# EAGLE schematic Ex EEPROM (EAGLE 9.6.2)
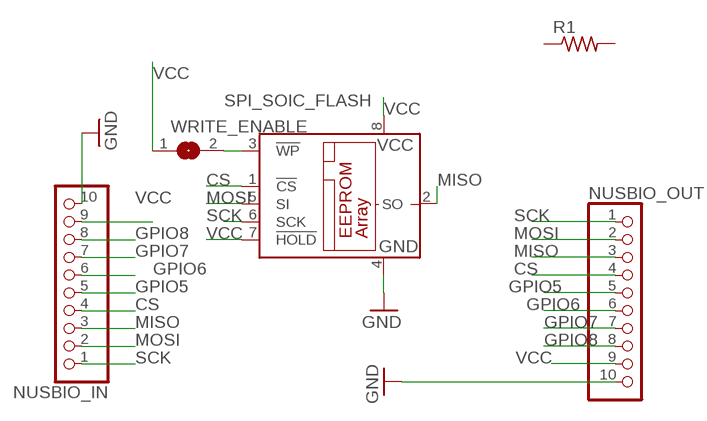
[diagram p0: schematic, sheet 1]

## Parts
NUSBIO_IN  PINHD-1X10  [1X10-BIG]
NUSBIO_OUT  PINHD-1X10  [1X10-BIG]
R1  R-US_R1206  [R1206]
SPI_SOIC_FLASH  25AA080SN  [SO-08]
WRITE_ENABLE  SOLDERJUMPERREFLOW  [SOLDERJUMPER_REFLOW]

## Nets
CS: NUSBIO_IN.4 NUSBIO_OUT.4 SPI_SOIC_FLASH.1(!CS)
GND: NUSBIO_IN.10 NUSBIO_OUT.10 SPI_SOIC_FLASH.4(GND)
GPIO5: NUSBIO_IN.5 NUSBIO_OUT.5
GPIO6: NUSBIO_IN.6 NUSBIO_OUT.6
GPIO7: NUSBIO_IN.7 NUSBIO_OUT.7
GPIO8: NUSBIO_IN.8 NUSBIO_OUT.8
MISO: NUSBIO_IN.3 NUSBIO_OUT.3 SPI_SOIC_FLASH.2(SO)
MOSI: NUSBIO_IN.2 NUSBIO_OUT.2 SPI_SOIC_FLASH.5(SI)
N$1: SPI_SOIC_FLASH.3(!WP) WRITE_ENABLE.2
SCK: NUSBIO_IN.1 NUSBIO_OUT.1 SPI_SOIC_FLASH.6(SCK)
VCC: NUSBIO_IN.9 NUSBIO_OUT.9 SPI_SOIC_FLASH.7(!HOLD) SPI_SOIC_FLASH.8(VCC) WRITE_ENABLE.1
Unconnected: R1.1 R1.2

## Library data of the parts
NUSBIO_IN NUSBIO_OUT = adafruit:PINHD-1X10: Pin header 1x10 0.1" spacing With round pins
R1 = adafruit:R-US_: RESISTOR, American symbol
SPI_SOIC_FLASH = microchip:25*: Serial EEPROM 4K/ 8K , SPI bus; MF: MICROCHIP; MPN: 25AA080/SN; OC_FARNELL: 1816072; OC_NEWARK: 92C7351
WRITE_ENABLE = microbuilder:SOLDERJUMPER: SMD Solder JUMPER Solder the two pads together to create a connection, or remove the solder to break it. REFLOW - Use this footprint for solder paste and reflow ovens. WAVE - Use this footprint for hand-soldering (larger pads). CLOSED - Has a trace between the two pads to ensure it is closed by default. The trace needs to be cut to disable the jumper, and can be closed again by creating a solder bridge between the two pads.